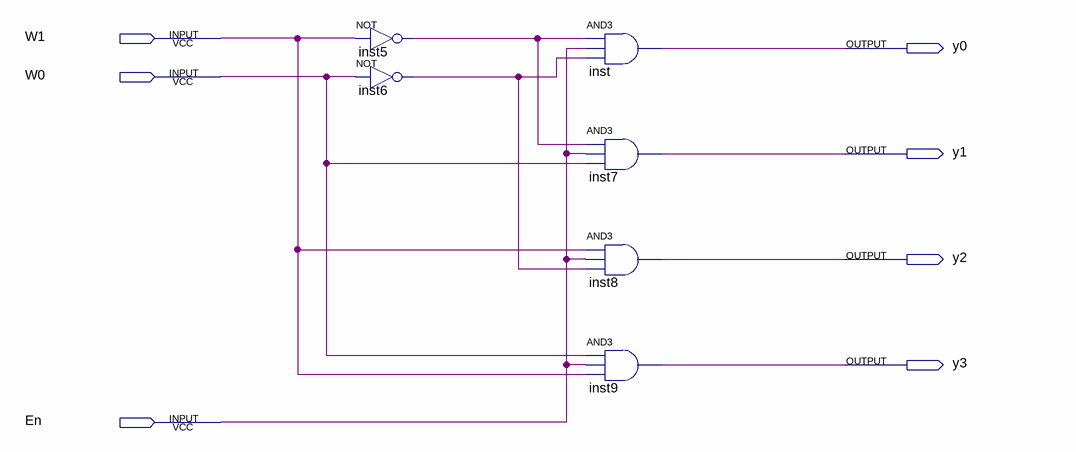
[diagram p0: schematic sheet]
// Quartus schematic 2-4_decoder.bdf as structural Verilog: 6 symbols, 7 pins
module \2-4_decoder  (
  input  W1,
  input  W0,
  input  En,
  output y0,
  output y1,
  output y2,
  output y3
);

  wire inst5_out, inst6_out;

  not inst5 (inst5_out, W1);
  not inst6 (inst6_out, W0);
  and inst (y0, inst5_out, En, inst6_out);
  and inst7 (y1, inst5_out, En, W0);
  and inst8 (y2, W1, En, inst6_out);
  and inst9 (y3, W0, En, W1);
endmodule
